# Altium schematic sheet hierarchy.SchDoc
size A4; SheetNumber: 1; SheetTotal: 13
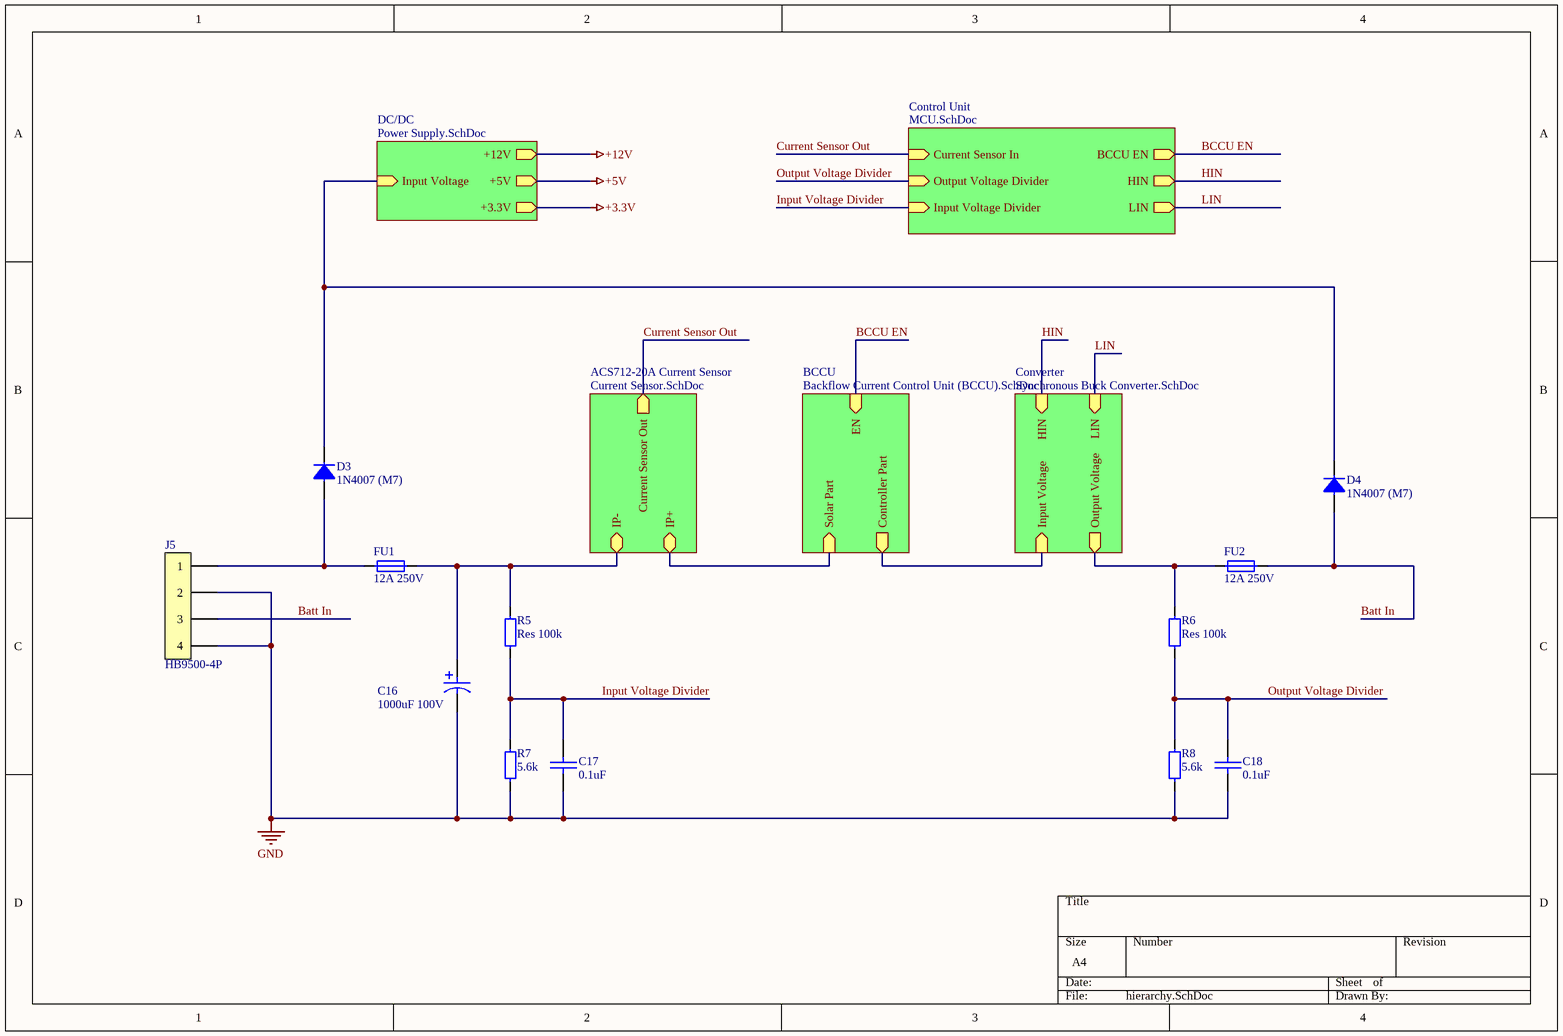
[diagram p0: hierarchy.SchDoc]

## Parts
C16  1000uF 100V
C17  0.1uF  [0805 Capicator]
C18  0.1uF  [0805 Capicator]
D3  1N4007 (M7)  [SMA]
D4  1N4007 (M7)  [SMA]
FU1  12A 250V  [Fuse Glass 5x20]
FU2  12A 250V  [Fuse Glass 5x20]
J5  HB9500-4P  [HB-9500-9.5-4p]
R5  Res 100k  [0805 Resistor]
R6  Res 100k  [0805 Resistor]
R7  5.6k  [0805 Resistor]
R8  5.6k  [0805 Resistor]

## Sub-sheets
ACS712-20A Current Sensor = Current Sensor.SchDoc: Current Sensor Out (out), IP- (bidir), IP+ (bidir)
BCCU = Backflow Current Control Unit (BCCU).SchDoc: Controller Part (out), Solar Part (in), EN (in)
Control Unit = MCU.SchDoc: Input Voltage Divider (in), Output Voltage Divider (in), Current Sensor In (in), BCCU EN (out), HIN (out), LIN (out)
Converter = Synchronous Buck Converter.SchDoc: HIN (in), LIN (in), Input Voltage (in), Output Voltage (out)
DC/DC = Power Supply.SchDoc: Input Voltage (in), +12V (out), +5V (out), +3.3V (out)

## Nets
+3.3V: sheet DC/DC/+3.3V
+5V: sheet DC/DC/+5V
+12V: sheet DC/DC/+12V
GND: C16.1 C17.1 C18.1 J5.2 J5.4 R7.1 R8.1
Batt In: D4.1 FU2.2 J5.3
BCCU EN: sheet BCCU/EN, sheet Control Unit/BCCU EN
Current Sensor Out: sheet ACS712-20A Current Sensor/Current Sensor Out, sheet Control Unit/Current Sensor In
HIN: sheet Converter/HIN, sheet Control Unit/HIN
Input Voltage Divider: C17.2 R5.1 R7.2 ; sheet Control Unit/Input Voltage Divider
LIN: sheet Converter/LIN, sheet Control Unit/LIN
Output Voltage Divider: C18.2 R6.1 R8.2 ; sheet Control Unit/Output Voltage Divider
NetC16_2: C16.2 FU1.2 R5.2 ; sheet ACS712-20A Current Sensor/IP-
NetD3_1: D3.1 FU1.1 J5.1
NetD3_2: D3.2 D4.2 ; sheet DC/DC/Input Voltage
NetFU2_1: FU2.1 R6.2 ; sheet Converter/Output Voltage
(unnamed): sheet ACS712-20A Current Sensor/IP+, sheet BCCU/Solar Part
(unnamed): sheet BCCU/Controller Part, sheet Converter/Input Voltage

## Library data of the parts
C16 = Capacitor 1000uF 100V: 1000мкФ, 100В, 105°C, 20%, 18*40мм P:7,5мм; ComponentLink1Description: Buy; ComponentLink1URL: https://www.chipdip.ru/product0/9000565922
C17 C18 = Cap 0.1uF (0805): 0.1uF X7R 25V 10% 0805; Manufacturer: Murata Manufacturing; Part Number: GRM21BR71E104KA01L; Type: Capacitor; ComponentLink1Description: Chip&Dip; ComponentLink1URL: https://www.chipdip.ru/product/grm21br71e104ka01l
D3 D4 = Diode 1N4007 (M7): Diode 1A 1000V; Type: Diode; ComponentLink1Description: Buy; ComponentLink1URL: https://radioremont.com/product/diod-m7-1n4007-k15-8/; ComponentLink2Description: Datasheet; ComponentLink2URL: https://static.chipdip.ru/lib/981/DOC020981108.pdf
FU1 FU2 = Fuse 12A 250V: Fusible link H520B 12A 250 V, 5×20, Fast acting fuse (blister); Type: Fuse; ComponentLink1Description: Buy; ComponentLink1URL: https://www.chipdip.ru/product0/9000339437
J5 = Barrier Terminal Connector HB9500-4P: Barrier P-9.5mm terminal; Type: Connector; ComponentLink1Description: Buy; ComponentLink1URL: https://radioremont.com/product/klemma-kf45-9500-shag-9-5mm-4pin-h1-25/
R5 R6 = Res 100k (0805): 0.125W 0805 100k, 1%; Part Number: RC0805FR-07100KL; Manufacturer: Taiwan; Type: Resistor; ComponentLink1Description: Chip&Dip; ComponentLink1URL: https://www.chipdip.ru/product0/9000079538
R7 R8 = Resisot 5.6k (0805): 0805 0.125W 5% 5,6 kOhm; ComponentLink1Description: Buy; ComponentLink1URL: https://radioremont.com/product/rezistor-0805-0-125-vt-5-5-6-kom-10-shtuk-r24-49/; Type: Resistor